# Altium schematic sheet P-MT3620RDB-1-0_FTDI.SchDoc: MT3620 RDB FTDI
size A3; CompanyName: Microsoft Research; DrawnBy: Stuart Taylor; Revision: 1.0; SheetNumber: 4; SheetTotal: 5; ProjectName: MT3620 Reference Development Board
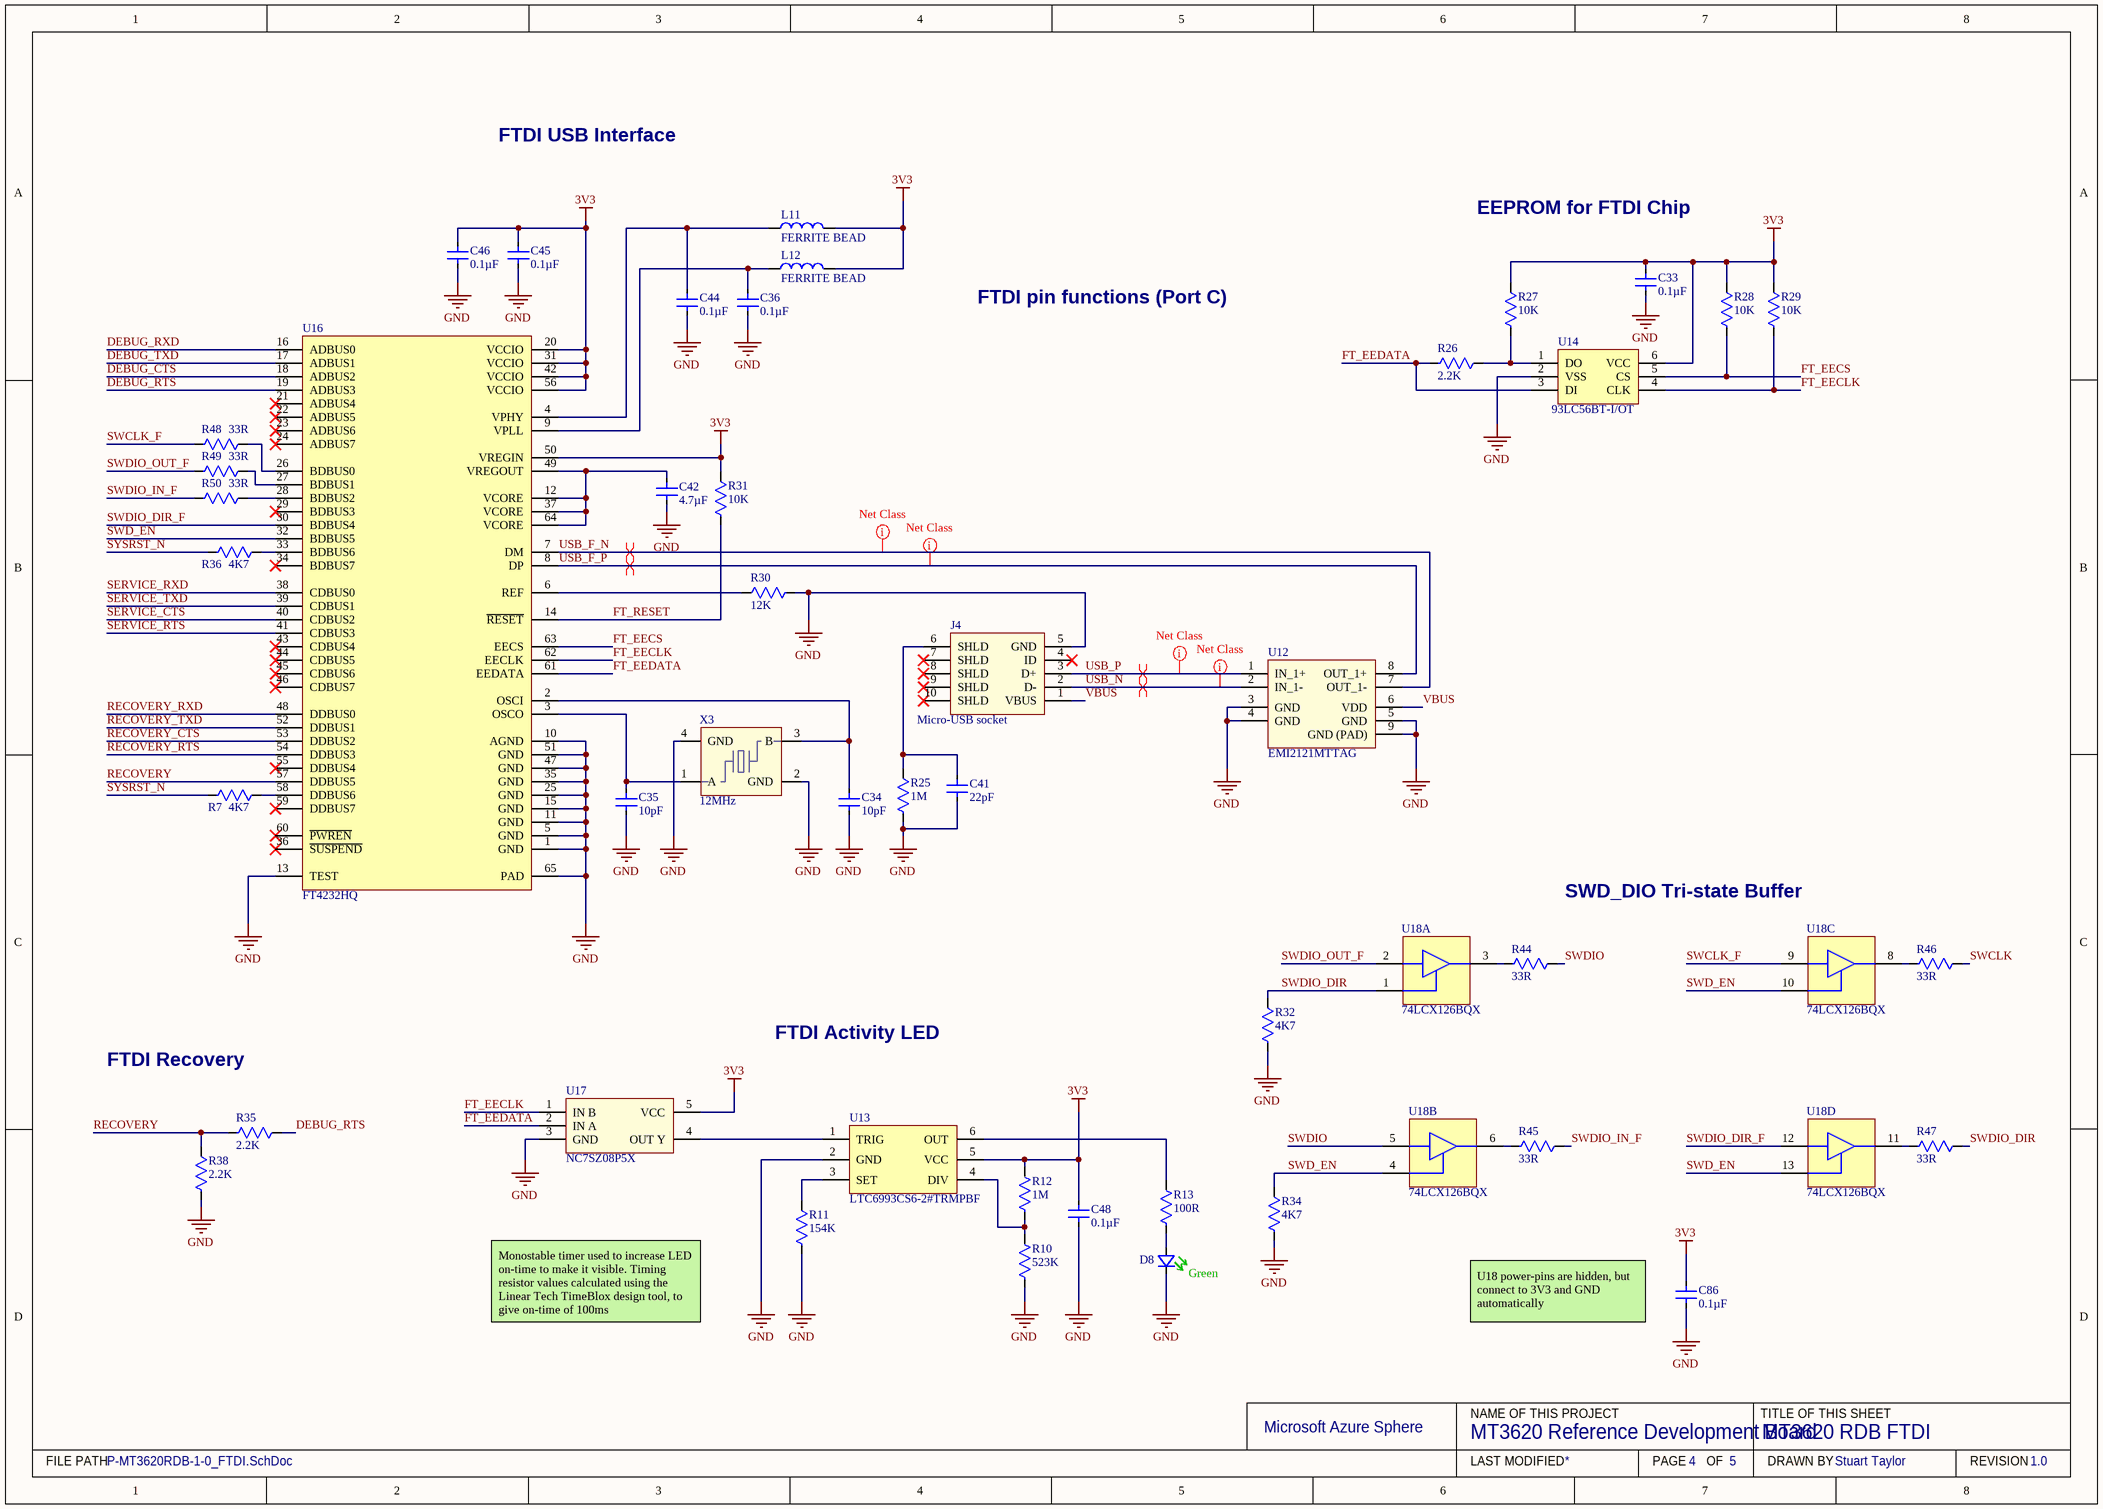
[diagram p0: P-MT3620RDB-1-0_FTDI.SchDoc]

## Parts
C33  0.1µF  [CAPC1005-EIA0402 0.55MM MED]
C34  10pF  [CAPC1005-EIA0402 0.55MM MED]
C35  10pF  [CAPC1005-EIA0402 0.55MM MED]
C36  0.1µF  [CAPC1005-EIA0402 0.55MM MED]
C41  22pF  [CAPC1005-EIA0402 0.55MM MED]
C42  4.7µF  [CAPC1005-EIA0402 0.55MM MED]
C44  0.1µF  [CAPC1005-EIA0402 0.55MM MED]
C45  0.1µF  [CAPC1005-EIA0402 0.55MM MED]
C46  0.1µF  [CAPC1005-EIA0402 0.55MM MED]
C48  0.1µF  [CAPC1005-EIA0402 0.55MM MED]
C86  0.1µF  [CAPC1005-EIA0402 0.55MM MED]
D8  Colour: Green  [Rohm SML-D12 Green]  (hidden comment: Green LED)
J4  Micro-USB socket  [MCR-B-S-RA-SMT-CS5-T/R]
L11  FERRITE BEAD  [CAPC1005-EIA0402 0.55MM MED]
L12  FERRITE BEAD  [CAPC1005-EIA0402 0.55MM MED]
R7  4K7  [RES 0402 MEDIUM DENSITY]
R10  523K  [RES 0402 MEDIUM DENSITY]
R11  154K  [RES 0402 MEDIUM DENSITY]
R12  1M  [RES 0402 MEDIUM DENSITY]
R13  100R  [RES 0402 MEDIUM DENSITY]
R25  1M  [RES 0402 MEDIUM DENSITY]
R26  2.2K  [RES 0402 MEDIUM DENSITY]
R27  10K  [RES 0402 MEDIUM DENSITY]
R28  10K  [RES 0402 MEDIUM DENSITY]
R29  10K  [RES 0402 MEDIUM DENSITY]
R30  12K  [RES 0402 MEDIUM DENSITY]
R31  10K  [RES 0402 MEDIUM DENSITY]
R32  4K7  [RES 0402 MEDIUM DENSITY]
R34  4K7  [RES 0402 MEDIUM DENSITY]
R35  2.2K  [RES 0402 MEDIUM DENSITY]
R36  4K7  [RES 0402 MEDIUM DENSITY]
R38  2.2K  [RES 0402 MEDIUM DENSITY]
R44  33R  [RES 0402 MEDIUM DENSITY]
R45  33R  [RES 0402 MEDIUM DENSITY]
R46  33R  [RES 0402 MEDIUM DENSITY]
R47  33R  [RES 0402 MEDIUM DENSITY]
R48  33R  [RES 0402 MEDIUM DENSITY]
R49  33R  [RES 0402 MEDIUM DENSITY]
R50  33R  [RES 0402 MEDIUM DENSITY]
U12  EMI2121MTTAG  [EMI2121MTTAG]
U13  LTC6993CS6-2#TRMPBF  [LTC6993CS6-2#TRMPBF]
U14  93LC56BT-I/OT  [SOT23-93C56B]
U16  FT4232HQ  [FTDI_TF4232HQ_64QFN]
U17  NC7SZ08P5X  [SC-70-5]
U18  74LCX126BQX  [74LCX126BQX]  (parts A,B,C,D of 4)
X3  12MHz  [TXC 8Z]

## Nets
3V3: C33.2 C45.2 C46.2 C48.2 C86.2 L11.2 L12.2 R12.1 R27.1 R28.1 R29.1 R31.1 U13.5(VCC) U14.6(VCC) U16.20(VCCIO) U16.31(VCCIO) U16.42(VCCIO) U16.50(VREGIN) U16.56(VCCIO) U17.5(VCC) U18.14(3V3)
GND: C33.1 C34.1 C35.1 C36.1 C41.1 C42.1 C44.1 C45.1 C46.1 C48.1 C86.1 D8.1(K) J4.5(GND) R10.2 R11.2 R25.2 R30.2 R32.2 R34.2 R38.2 U12.3(GND) U12.4(GND) U12.5(GND) U12.9(GND_(PAD)) U13.2(GND) U14.2(VSS) U16.1(GND) U16.5(GND) U16.10(AGND) U16.11(GND) U16.13(TEST) U16.15(GND) U16.25(GND) U16.35(GND) U16.47(GND) U16.51(GND) U16.65(PAD) U17.3(GND) U18.7(GND) X3.2(GND) X3.4(GND)
DEBUG_CTS: U16.18(ADBUS2)
DEBUG_RTS: R35.1 U16.19(ADBUS3)
DEBUG_RXD: U16.16(ADBUS0)
DEBUG_TXD: U16.17(ADBUS1)
FT_EECLK: R29.2 U14.4(CLK) U16.62(EECLK) U17.1(IN_B)
FT_EECS: R28.2 U14.5(CS) U16.63(EECS)
FT_EEDATA: R26.2 U14.3(DI) U16.61(EEDATA) U17.2(IN_A)
FT_RESET: R31.2 U16.14(~{RESET})
RECOVERY: R35.2 R38.1 U16.57(DDBUS5)
RECOVERY_CTS: U16.53(DDBUS2)
RECOVERY_RTS: U16.54(DDBUS3)
RECOVERY_RXD: U16.48(DDBUS0)
RECOVERY_TXD: U16.52(DDBUS1)
SERVICE_CTS: U16.40(CDBUS2)
SERVICE_RTS: U16.41(CDBUS3)
SERVICE_RXD: U16.38(CDBUS0)
SERVICE_TXD: U16.39(CDBUS1)
SWCLK: R46.1
SWCLK_F: R48.2 U18.9(3A)
SWD_EN: R34.1 U16.32(BDBUS5) U18.4(2OE) U18.10(3OE) U18.13(4OE)
SWDIO: R44.1 U18.5(2A)
SWDIO_DIR: R32.1 R47.1 U18.1(1OE)
SWDIO_DIR_F: U16.30(BDBUS4) U18.12(4A)
SWDIO_IN_F: R45.1 R50.2
SWDIO_OUT_F: R49.2 U18.2(1A)
SYSRST_N: R7.2 R36.2
USB_F_N: U12.7(OUT_1-) U16.7(DM)
USB_F_P: U12.8(OUT_1+) U16.8(DP)
USB_N: J4.2(D-) U12.2(IN_1-)
USB_P: J4.3(D+) U12.1(IN_1+)
VBUS: J4.1(VBUS) U12.6(VDD)
NetC34_2: C34.2 U16.2(OSCI) X3.3(B)
NetC35_2: C35.2 U16.3(OSCO) X3.1(A)
NetC36_2: C36.2 L12.1 U16.9(VPLL)
NetC41_2: C41.2 J4.6(SHLD) R25.1
NetC42_2: C42.2 U16.12(VCORE) U16.37(VCORE) U16.49(VREGOUT) U16.64(VCORE)
NetC44_2: C44.2 L11.1 U16.4(VPHY)
NetD8_2: D8.2(A) R13.2
NetR7_1: R7.1 U16.58(DDBUS6)
NetR10_1: R10.1 R12.2 U13.4(DIV)
NetR11_1: R11.1 U13.3(SET)
NetR13_1: R13.1 U13.6(OUT)
NetR26_1: R26.1 R27.2 U14.1(DO)
NetR30_1: R30.1 U16.6(REF)
NetR36_1: R36.1 U16.33(BDBUS6)
NetR44_2: R44.2 U18.3(1Y)
NetR45_2: R45.2 U18.6(2Y)
NetR46_2: R46.2 U18.8(3Y)
NetR47_2: R47.2 U18.11(4Y)
NetR48_1: R48.1 U16.26(BDBUS0)
NetR49_1: R49.1 U16.27(BDBUS1)
NetR50_1: R50.1 U16.28(BDBUS2)
NetU13_1: U13.1(TRIG) U17.4(OUT_Y)

Not connected (* = marked no-connect by the designer): J4 4(ID)* 7(SHLD)* 8(SHLD)* 9(SHLD)* 10(SHLD)*; U16 21(ADBUS4)* 22(ADBUS5)* 23(ADBUS6)* 24(ADBUS7)* 29(BDBUS3)* 34(BDBUS7)* 36(~{SUSPEND})* 43(CDBUS4)* 44(CDBUS5)* 45(CDBUS6)* 46(CDBUS7)* 55(DDBUS4)* 59(DDBUS7)* 60(~{PWREN})*

## Layout directives
differential pair: USB_F_N, USB_F_P, USB_N, USB_P
net class USB: USB_F_N, USB_F_P, USB_N, USB_P

## Notes on the sheet
- FTDI USB Interface
- EEPROM for FTDI Chip
- FTDI pin functions (Port C)
- SWD_DIO Tri-state Buffer
- FTDI Activity LED
- FTDI Recovery
- Monostable timer used to increase LED on-time to make it visible. Timing resistor values calculated using the Linear Tech TimeBlox design tool, to give on-time of 100ms
- (near C86) U18 power-pins are hidden, but connect to 3V3 and GND automatically
- Microsoft Azure Sphere
- NAME OF THIS PROJECT
- TITLE OF THIS SHEET
- FILE PATH
- LAST MODIFIED
- PAGE
- OF
- DRAWN BY
- REVISION

## Library data of the parts
C33 C36 C44-C46 C48 C86 = 0.1µF 0402 X7R 50V: CAP CER 0.1UF 50V 10% X7R 0402; Manufacturer: TDK Corporation; Manufacturer Part Number: C1005X7R1H104K050BB; Supplier 1: Digi-Key; RoHS: RoHS Compliant; Category: Capacitors; Stock 1: 47833; Pricing 1: 0.01305; Packaging: Tape & Reel (TR); Tolerance: ±10%; Voltage - Rated: 50V; Temperature Coefficient: X7R; Mounting Type: Surface Mount, MLCC; Operating Temperature: -55°C ~ 125°C; Applications: General Purpose; Package / Case: 0402 (1005 Metric); Size / Dimension: 0.039" L x 0.020" W (1.00mm x 0.50mm); Height - Seated (Max): -; Thickness (Max): 0.022" (0.55mm); Lead Spacing: -; Features: -; Lead Style: -; ComponentLink1URL: http://product.tdk.com/en/catalog/datasheets/mlcc_commercial_general_en.pdf; ComponentLink1Description: http://product.tdk.com/en/catalog/datasheets/mlcc_commercial_general_en.pdf; Supplier Part Number 1: 445-5932-2-ND; Ratings: -; Capacitance: 0.1µF
C34 C35 = 10pF 0402 C0G, NP0 50V: CAP CER 10PF 50V NP0 0402; Manufacturer: TDK Corporation; Manufacturer Part Number: C1005C0G1H100D050BA; Tolerance: ±0.5pF; Supplier 1: Digi-Key; RoHS: RoHS Compliant; Category: Capacitors; Stock 1: 47833; Pricing 1: 0.00274; Packaging: Tape & Reel (TR); Voltage - Rated: 50V; Temperature Coefficient: C0G, NP0; Mounting Type: Surface Mount, MLCC; Operating Temperature: -55°C ~ 125°C; Applications: General Purpose; Package / Case: 0402 (1005 Metric); Size / Dimension: 0.039" L x 0.020" W (1.00mm x 0.50mm); Height - Seated (Max): -; Thickness (Max): 0.022" (0.55mm); Lead Spacing: -; Features: -; Lead Style: -; ComponentLink1URL: http://product.tdk.com/en/catalog/datasheets/mlcc_commercial_general_en.pdf; ComponentLink1Description: http://product.tdk.com/en/catalog/datasheets/mlcc_commercial_general_en.pdf; Supplier Part Number 1: 445-1235-2-ND; Ratings: -; Capacitance: 10pF
C41 = 22pF 0402 C0G, NP0 50V: CAP CER 22PF 50V 5% NP0 0402; Manufacturer: TDK Corporation; Manufacturer Part Number: C1005C0G1H220J050BA; Supplier 1: Digi-Key; RoHS: RoHS Compliant; Category: Capacitors; Stock 1: 47833; Pricing 1: 0.00274; Packaging: Tape & Reel (TR); Tolerance: ±5%; Voltage - Rated: 50V; Temperature Coefficient: C0G, NP0; Mounting Type: Surface Mount, MLCC; Operating Temperature: -55°C ~ 125°C; Applications: General Purpose; Package / Case: 0402 (1005 Metric); Size / Dimension: 0.039" L x 0.020" W (1.00mm x 0.50mm); Height - Seated (Max): -; Thickness (Max): 0.022" (0.55mm); Lead Spacing: -; Features: -; Lead Style: -; ComponentLink1URL: http://product.tdk.com/en/catalog/datasheets/mlcc_commercial_general_en.pdf; ComponentLink1Description: http://product.tdk.com/en/catalog/datasheets/mlcc_commercial_general_en.pdf; Supplier Part Number 1: 445-1239-2-ND; Ratings: -; Capacitance: 22pF
C42 = 4.7µF 0402 X5R 10V: CAP CER 4.7UF 10V 10% X5R 0402; Manufacturer: TDK Corporation; Manufacturer Part Number: C1005X5R1A475K050BC; Supplier 1: Digi-Key; RoHS: RoHS Compliant; Category: Capacitors; Stock 1: 47833; Pricing 1: 0.06265; Packaging: Tape & Reel (TR); Tolerance: ±10%; Voltage - Rated: 10V; Temperature Coefficient: X5R; Mounting Type: Surface Mount, MLCC; Operating Temperature: -55°C ~ 125°C; Applications: General Purpose; Package / Case: 0402 (1005 Metric); Size / Dimension: 0.039" L x 0.020" W (1.00mm x 0.50mm); Height - Seated (Max): -; Thickness (Max): 0.022" (0.55mm); Lead Spacing: -; Features: -; Lead Style: -; ComponentLink1URL: http://product.tdk.com/en/catalog/datasheets/mlcc_commercial_general_en.pdf; ComponentLink1Description: http://product.tdk.com/en/catalog/datasheets/mlcc_commercial_general_en.pdf; Supplier Part Number 1: 445-13820-2-ND; Ratings: -; Capacitance: 4.7µF
D8 = SML-D12P: 1.6 x 0.8 x 0.55mm (0603) LED 560nm Green; Manufacturer: Rohm Semiconductor; Manufacturer Part Number: SML-D12P8WT86; Millicandela Rating: 6.3mcd; Voltage - Forward (Vf) (Typ): 2.2V; Current - Test: 20mA; Lens Type: Diffused, White; Lens Style/Size: Rectangle with Flat Top, 1.2mm x 0.8mm; Supplier 1: Digi-Key; RoHS: RoHS Compliant; Category: Optoelectronics; Stock 1: 19305; Pricing 1: 1=0.38, 10=0.279, 25=0.2232, 100=0.1478, 250=0.1046, 500=0.08926, 1000=0.06974 (GBP); Packaging: Cut Tape (CT); Wavelength - Dominant: 560nm; Wavelength - Peak: -; Viewing Angle: -; Package / Case: 0603 (1608 Metric); Size / Dimension: 1.60mm L x 0.80mm W; Height: 0.55mm; Mounting Type: Surface Mount; Luminous Flux @ Current - Test: -; ComponentLink1URL: http://rohmfs.rohm.com/en/products/databook/datasheet/opto/led/chip_mono/sml-d1.pdf; ComponentLink1Description: http://rohmfs.rohm.com/en/products/databook/datasheet/opto/led/chip_mono/sml-d1.pdf; Supplier Part Number 1: 511-1579-1-ND
J4 = MCR-B-S-RA-SMT-CS5-T/R: Manufacturer: Adam Tech; Manufacturers Part Number: MCR-B-S-RA-SMT-CS5-T/R; Supplier Part Number 1: MCR-B-S-RA-SMT-CS5-T/R; Supplier 1: Adam Tech
L11 L12 = BLM15PD121SN1D: FERRITE BEAD 120 OHM 0402 1LN; Manufacturer: Murata Electronics North America; Filter Type: Power Line; Number of Lines: 1; Impedance @ Frequency: 120 Ohm @ 100MHz; Current Rating (Max): 1.3A; DC Resistance (DCR) (Max): 90 mOhm; Supplier 1: Digi-Key; Manufacturer Part Number: BLM15PD121SN1D; RoHS: RoHS Compliant; Category: Filters; Stock 1: 50000; Pricing 1: 10000=0.01677, 20000=0.01557, 30000=0.0154, 50000=0.01498 (GBP); Packaging: Tape & Reel (TR); Ratings: -; Operating Temperature: -55°C ~ 125°C; Package / Case: 0402 (1005 Metric); Mounting Type: Surface Mount; Height (Max): 0.022" (0.55mm); Size / Dimension: 0.039" L x 0.020" W (1.00mm x 0.50mm); ComponentLink1URL: http://search.murata.co.jp/Ceramy/image/img/PDF/ENG/L0110S0100BLM15PG~BLM15PD.pdf; ComponentLink1Description: http://search.murata.co.jp/Ceramy/image/img/PDF/ENG/L0110S0100BLM15PG~BLM15PD.pdf; Supplier Part Number 1: 490-5203-2-ND
R7 R32 R34 R36 = 4.7K: RES 4.7K OHM 1/10W 1% 0402 SMD; Manufacturer: Panasonic Electronic Components; Manufacturer Part Number: ERJ-2RKF4701X; Power (Watts): 0.1W, 1/10W; Temperature Coefficient: ±100ppm/°C; Supplier 1: Digi-Key; Supplier Part Number 1: P4.70KLCT-ND; RoHS: RoHS Compliant; Category: Resistors; Stock 1: 1251398; Pricing 1: 1=0.07, 50=0.0128, 100=0.0097, 250=0.0072, 500=0.00532, 1000=0.00355, 5000=0.0025 (GBP); Packaging: Cut Tape (CT); Tolerance: ±1%; Composition: Thick Film; Features: -; Package / Case: 0402 (1005 Metric); Supplier Device Package: 0402; Size / Dimension: 0.039" L x 0.020" W (1.00mm x 0.50mm); Height: 0.016" (0.40mm); Number of Terminations: 2; ComponentLink1URL: http://industrial.panasonic.com/www-cgi/jvcr13pz.cgi?E+PZ+3+AOA0002+ERJ2RKF4701X+7+WW; ComponentLink1Description: http://industrial.panasonic.com/www-cgi/jvcr13pz.cgi?E+PZ+3+AOA0002+ERJ2RKF4701X+7+WW; Resistance (Ohms): 4K7
R10 = 523K: RES 523K OHM 1/10W 1% 0402 SMD; Manufacturer: Panasonic Electronic Components; Manufacturer Part Number: ERJ-2RKF5233X; Power (Watts): 0.1W, 1/10W; Temperature Coefficient: ±100ppm/°C; Supplier 1: Digi-Key; Supplier Part Number 1: P523KLCT-ND; RoHS: RoHS Compliant; Category: Resistors; Stock 1: 62611; Pricing 1: 1=0.07, 50=0.0128, 100=0.0097, 250=0.0072, 500=0.00532, 1000=0.00355, 5000=0.0025 (GBP); Packaging: Cut Tape (CT); Tolerance: ±1%; Composition: Thick Film; Features: -; Package / Case: 0402 (1005 Metric); Supplier Device Package: 0402; Size / Dimension: 0.039" L x 0.020" W (1.00mm x 0.50mm); Height: 0.016" (0.40mm); Number of Terminations: 2; ComponentLink1URL: http://industrial.panasonic.com/www-cgi/jvcr13pz.cgi?E+PZ+3+AOA0002+ERJ2RKF5233X+7+WW; ComponentLink1Description: http://industrial.panasonic.com/www-cgi/jvcr13pz.cgi?E+PZ+3+AOA0002+ERJ2RKF5233X+7+WW; Resistance (Ohms): 523K
R11 = 154K: RES 154K OHM 1/10W 1% 0402 SMD; Manufacturer: Panasonic Electronic Components; Manufacturer Part Number: ERJ-2RKF1543X; Power (Watts): 0.1W, 1/10W; Temperature Coefficient: ±100ppm/°C; Supplier 1: Digi-Key; Supplier Part Number 1: P154KLCT-ND; RoHS: RoHS Compliant; Category: Resistors; Stock 1: 93656; Pricing 1: 1=0.07, 50=0.0128, 100=0.0097, 250=0.0072, 500=0.00532, 1000=0.00355, 5000=0.0025 (GBP); Packaging: Cut Tape (CT); Tolerance: ±1%; Composition: Thick Film; Features: -; Package / Case: 0402 (1005 Metric); Supplier Device Package: 0402; Size / Dimension: 0.039" L x 0.020" W (1.00mm x 0.50mm); Height: 0.016" (0.40mm); Number of Terminations: 2; ComponentLink1URL: http://industrial.panasonic.com/www-cgi/jvcr13pz.cgi?E+PZ+3+AOA0002+ERJ2RKF1543X+7+WW; ComponentLink1Description: http://industrial.panasonic.com/www-cgi/jvcr13pz.cgi?E+PZ+3+AOA0002+ERJ2RKF1543X+7+WW; Resistance (Ohms): 154K
R12 R25 = 1M: RES 1M OHM 1/10W 1% 0402 SMD; Manufacturer: Panasonic Electronic Components; Manufacturer Part Number: ERJ-2RKF1004X; Power (Watts): 0.1W, 1/10W; Temperature Coefficient: ±100ppm/°C; Supplier 1: Digi-Key; Supplier Part Number 1: P1.00MLCT-ND; RoHS: RoHS Compliant; Category: Resistors; Stock 1: 749171; Pricing 1: 1=0.07, 50=0.0128, 100=0.0097, 250=0.0072, 500=0.00532, 1000=0.00355, 5000=0.0025 (GBP); Packaging: Cut Tape (CT); Tolerance: ±1%; Composition: Thick Film; Features: -; Package / Case: 0402 (1005 Metric); Supplier Device Package: 0402; Size / Dimension: 0.039" L x 0.020" W (1.00mm x 0.50mm); Height: 0.016" (0.40mm); Number of Terminations: 2; ComponentLink1URL: http://industrial.panasonic.com/www-cgi/jvcr13pz.cgi?E+PZ+3+AOA0002+ERJ2RKF1004X+7+WW; ComponentLink1Description: http://industrial.panasonic.com/www-cgi/jvcr13pz.cgi?E+PZ+3+AOA0002+ERJ2RKF1004X+7+WW; Resistance (Ohms): 1M
R13 = 100R: RES 100 OHM 1/10W 1% 0402 SMD; Manufacturer: Panasonic Electronic Components; Manufacturer Part Number: ERJ-2RKF1000X; Power (Watts): 0.1W, 1/10W; Temperature Coefficient: ±100ppm/°C; Supplier 1: Digi-Key; RoHS: RoHS Compliant; Category: Resistors; Stock 1: 3662159; Pricing 1: 1=0.07, 50=0.0128, 100=0.0097, 250=0.0072, 500=0.00532, 1000=0.00355, 5000=0.0025 (GBP); Packaging: Cut Tape (CT); Tolerance: ±1%; Composition: Thick Film; Features: -; Package / Case: 0402 (1005 Metric); Supplier Device Package: 0402; Size / Dimension: 0.039" L x 0.020" W (1.00mm x 0.50mm); Height: 0.016" (0.40mm); Number of Terminations: 2; ComponentLink1URL: http://industrial.panasonic.com/www-cgi/jvcr13pz.cgi?E+PZ+3+AOA0002+ERJ2RKF1000X+7+WW; ComponentLink1Description: http://industrial.panasonic.com/www-cgi/jvcr13pz.cgi?E+PZ+3+AOA0002+ERJ2RKF1000X+7+WW; Supplier Part Number 1: P100LCT-ND; Resistance (Ohms): 100R
R26 R35 R38 = 2.2K: RES 2.2K OHM 1/10W 1% 0402 SMD; Manufacturer: Panasonic Electronic Components; Manufacturer Part Number: ERJ-2RKF2201X; Power (Watts): 0.1W, 1/10W; Temperature Coefficient: ±100ppm/°C; Supplier 1: Digi-Key; Supplier Part Number 1: P2.20KLCT-ND; RoHS: RoHS Compliant; Category: Resistors; Stock 1: 529147; Pricing 1: 1=0.07, 50=0.0128, 100=0.0097, 250=0.0072, 500=0.00532, 1000=0.00355, 5000=0.0025 (GBP); Packaging: Cut Tape (CT); Tolerance: ±1%; Composition: Thick Film; Features: -; Package / Case: 0402 (1005 Metric); Supplier Device Package: 0402; Size / Dimension: 0.039" L x 0.020" W (1.00mm x 0.50mm); Height: 0.016" (0.40mm); Number of Terminations: 2; ComponentLink1URL: http://industrial.panasonic.com/www-cgi/jvcr13pz.cgi?E+PZ+3+AOA0002+ERJ2RKF2201X+7+WW; ComponentLink1Description: http://industrial.panasonic.com/www-cgi/jvcr13pz.cgi?E+PZ+3+AOA0002+ERJ2RKF2201X+7+WW; Resistance (Ohms): 2.2K
R27-R29 R31 = 10K: RES 10K OHM 1/10W 1% 0402 SMD; Manufacturer: Panasonic Electronic Components; Manufacturer Part Number: ERJ-2RKF1002X; Power (Watts): 0.1W, 1/10W; Temperature Coefficient: ±100ppm/°C; Supplier 1: Digi-Key; Supplier Part Number 1: P10.0KLCT-ND; RoHS: RoHS Compliant; Category: Resistors; Stock 1: 4805447; Pricing 1: 1=0.07, 50=0.0128, 100=0.0097, 250=0.0072, 500=0.00532, 1000=0.00355, 5000=0.0025 (GBP); Packaging: Cut Tape (CT); Tolerance: ±1%; Composition: Thick Film; Features: -; Package / Case: 0402 (1005 Metric); Supplier Device Package: 0402; Size / Dimension: 0.039" L x 0.020" W (1.00mm x 0.50mm); Height: 0.016" (0.40mm); Number of Terminations: 2; ComponentLink1URL: http://industrial.panasonic.com/www-cgi/jvcr13pz.cgi?E+PZ+3+AOA0002+ERJ2RKF1002X+7+WW; ComponentLink1Description: http://industrial.panasonic.com/www-cgi/jvcr13pz.cgi?E+PZ+3+AOA0002+ERJ2RKF1002X+7+WW; Resistance (Ohms): 10K
R30 = 12K: RES 12K OHM 1/10W 1% 0402 SMD; Manufacturer: Panasonic Electronic Components; Manufacturer Part Number: ERJ-2RKF1202X; Power (Watts): 0.1W, 1/10W; Temperature Coefficient: ±100ppm/°C; Supplier 1: Digi-Key; Supplier Part Number 1: P12.0KLCT-ND; RoHS: RoHS Compliant; Category: Resistors; Stock 1: 165467; Pricing 1: 1=0.07, 50=0.0128, 100=0.0097, 250=0.0072, 500=0.00532, 1000=0.00355, 5000=0.0025 (GBP); Packaging: Cut Tape (CT); Tolerance: ±1%; Composition: Thick Film; Features: -; Package / Case: 0402 (1005 Metric); Supplier Device Package: 0402; Size / Dimension: 0.039" L x 0.020" W (1.00mm x 0.50mm); Height: 0.016" (0.40mm); Number of Terminations: 2; ComponentLink1URL: http://industrial.panasonic.com/www-cgi/jvcr13pz.cgi?E+PZ+3+AOA0002+ERJ2RKF1202X+7+WW; ComponentLink1Description: http://industrial.panasonic.com/www-cgi/jvcr13pz.cgi?E+PZ+3+AOA0002+ERJ2RKF1202X+7+WW; Resistance (Ohms): 12K
R44-R50 = 33R: RES 33 OHM 1/10W 1% 0402 SMD; Manufacturer: Panasonic Electronic Components; Manufacturer Part Number: ERJ-2RKF33R0X; Power (Watts): 0.1W, 1/10W; Temperature Coefficient: ±100ppm/°C; Supplier 1: Digi-Key; RoHS: RoHS Compliant; Category: Resistors; Stock 1: 533394; Pricing 1: 1=0.07, 50=0.0128, 100=0.0097, 250=0.0072, 500=0.00532, 1000=0.00355, 5000=0.0025 (GBP); Packaging: Cut Tape (CT); Tolerance: ±1%; Composition: Thick Film; Features: -; Package / Case: 0402 (1005 Metric); Supplier Device Package: 0402; Size / Dimension: 0.039" L x 0.020" W (1.00mm x 0.50mm); Height: 0.016" (0.40mm); Number of Terminations: 2; ComponentLink1URL: http://industrial.panasonic.com/www-cgi/jvcr13pz.cgi?E+PZ+3+AOA0002+ERJ2RKF33R0X+7+WW; ComponentLink1Description: http://industrial.panasonic.com/www-cgi/jvcr13pz.cgi?E+PZ+3+AOA0002+ERJ2RKF33R0X+7+WW; Supplier Part Number 1: P33.0LCT-ND; Resistance (Ohms): 33R
U12 = EMI2121MTTAG: IC FILTER COMMON MODE ESD 8WDFN; Manufacturer: ON Semiconductor; PCN Assembly/Origin: DFN Pkg Filters 12/Jun/2013 Addition of FAB 10 Wafer Source 04/Nov/2013 Assembly Site Addition 06/Mar/2014; Filter Type: Data, Signal Line; Number of Lines: 2; Current: 100mA; DC Resistance (DCR): 8 Ohm; Online Catalog: EMI; Other Names: EMI2121MTTAGOSDKR; Supplier 1: Digikey; Manufacturer Part Number: EMI2121MTTAG; Stock 1: 2368; Pricing 1: 1=0.85, 10=0.76, 100=0.5923, 500=0.4893, 1000=0.3863 (USD); Standard Package: 1; Category: Filters; Family: Common Mode Chokes; Series: -; Packaging: Digi-Reel®; Inductance: -; Impedance: -; Mounting Type: Surface Mount; Size / Dimension: 0.087" L x 0.079" W (2.20mm x 2.00mm); Height (Max): 0.031" (0.80mm); Package / Case: 8-WFDFN Exposed Pad; Operating Temperature: -40°C ~ 85°C; ComponentLink1URL: https://datasheet.ciiva.com/3067/emi2121mt-d-3067884.pdf; ComponentLink1Description: https://datasheet.ciiva.com/3067/emi2121mt-d-3067884.pdf; ComponentLink2URL: https://datasheet.ciiva.com/12394/emi2121mt-d-72518-12394918.pdf; ComponentLink2Description: https://datasheet.ciiva.com/12394/emi2121mt-d-72518-12394918.pdf; ComponentLink3URL: https://datasheet.ciiva.com/6214/emi2121mt-d-6214625.pdf; ComponentLink3Description: https://datasheet.ciiva.com/6214/emi2121mt-d-6214625.pdf; ComponentLink4URL: https://datasheet.ciiva.com/16437/emi2121mt-d-16437709.pdf; ComponentLink4Description: https://datasheet.ciiva.com/16437/emi2121mt-d-16437709.pdf; ComponentLink5URL: https://datasheet.ciiva.com/6214/emi2121mt-d-6214622.pdf; ComponentLink5Description: https://datasheet.ciiva.com/6214/emi2121mt-d-6214622.pdf; ComponentLink6URL: https://datasheet.ciiva.com/6214/emi2121mt-d-6214619.pdf; ComponentLink6Description: https://datasheet.ciiva.com/6214/emi2121mt-d-6214619.pdf; ComponentLink7URL: https://datasheet.ciiva.com/15162/getdatasheetpartid-686641-15162525.pdf; ComponentLink7Description: https://datasheet.ciiva.com/15162/getdatasheetpartid-686641-15162525.pdf; Supplier Part Number 1: EMI2121MTTAGOSCT-ND
U13 = LTC6993CS6-2#TRMPBF: LINEAR TECHNOLOGY - LTC6993CS6-2#TRMPBF - GENERATOR, PULSE, TIMERBLOX, 6SOT-23; Supply Voltage Min: 2.25; Supply Voltage Max: 5.5; Digital IC Case: TSOT-23; No. of Pins: 6; SVHC: No SVHC (17-Dec-2015); Clock External Input: No; No. of Timers: 1; Operating Mode: Monostable; Resonator Case: SMD; Supply Voltage Range: 2.25V to 5.5V<!--FANDB--><div class="features-and-benefits-container"><div class="features-and-benefits-description"><span class="features-benefits-value">The LTC6993CS6-2#TRMPBF is a Monostable Pulse Generator (one shot) with a programmable pulse width of 1?s to 33.6 seconds. The LTC6993 is part of the TimerBlox&reg; Supplier 1: Farnell; Manufacturer: LINEAR TECHNOLOGY; Manufacturer Part Number: LTC6993CS6-2#TRMPBF; RoHS: YES; Stock 1: 1214; Pricing 1: 1=2.64, 25=2.02, 100=1.18 (GBP); Frequency: -; Operating Temperature Min: 0; Operating Temperature Max: 70; Packaging: Cut Tape; Product Range: -; MSL: MSL 1 - Unlimited; Operating Temperature Range: 0°C to +70; ComponentLink1URL: http://www.farnell.com/datasheets/1441932.pdf; ComponentLink1Description: http://www.farnell.com/datasheets/1441932.pdf; ComponentLink2URL: http://www.farnell.com/simulation/1753930.zip; ComponentLink2Description: http://www.farnell.com/simulation/1753930.zip; ComponentLink3URL: http://www.farnell.com/datasheets/1999324.pdf; ComponentLink3Description: http://www.farnell.com/datasheets/1999324.pdf; ComponentLink4URL: http://www.farnell.com/cad/1542631.zip; ComponentLink4Description: http://www.farnell.com/cad/1542631.zip; Supplier Part Number 1: 1848054
U14 = 93LC56BT-I/OT: IC EEPROM 2KBIT 2MHZ SOT23-6; Manufacturer: Microchip Technology; Format - Memory: EEPROMs - Serial; Memory Size: 2K (128 x 16); Interface: Microwire, 3-Wire Serial; Voltage - Supply: 2.5 V ~ 5.5 V; Supplier 1: Digi-Key; Manufacturer Part Number: 93LC56BT-I/OT; RoHS: RoHS Compliant; Category: Integrated Circuits (ICs); Stock 1: 13464; Pricing 1: 1=0.17, 25=0.164, 100=0.1612 (GBP); Packaging: Cut Tape (CT); Part Status: Active; Memory Type: EEPROM; Speed: 2MHz; Operating Temperature: -40°C ~ 85°C (TA); Package / Case: SOT-23-6; Supplier Device Package: SOT-23-6; ComponentLink1URL: http://www.microchip.com/mymicrochip/filehandler.aspx?ddocname=en013939; ComponentLink1Description: http://www.microchip.com/mymicrochip/filehandler.aspx?ddocname=en013939; Supplier Part Number 1: 93LC56BT-I/OTCT-ND
U16 = FT4232HQ: IC USB HS QUAD UART/SYNC 64-QFN; Manufacturer: FTDI, Future Technology Devices International Ltd; Manufacturer Part Number: FT4232HQ-REEL; Function: Bridge, USB to UART; Interface: UART; Standards: USB 2.0; Voltage - Supply: 3 V ~ 3.6 V; Current - Supply: 70mA; Supplier 1: Digi-Key; RoHS: RoHS Compliant; Category: Integrated Circuits (ICs); Stock 1: 18296; Pricing 1: 1=5.99, 10=5.785, 50=5.5452, 100=4.6827, 250=4.1692, 500=3.79954 (GBP); Packaging: Cut Tape (CT); Protocol: USB; Operating Temperature: -40°C ~ 85°C; Package / Case: 64-VFQFN Exposed Pad; Supplier Device Package: 64-QFN (9x9); ComponentLink1URL: http://www.ftdichip.com/Support/Documents/DataSheets/ICs/DS_FT4232H.pdf; ComponentLink1Description: http://www.ftdichip.com/Support/Documents/DataSheets/ICs/DS_FT4232H.pdf; Supplier Part Number 1: 768-1027-1-ND
U17 = NC7SZ08P5X: IC GATE AND 1CH 2-INP SC-70-5; Manufacturer: Fairchild Semiconductor; Logic Type: AND Gate; Number of Circuits: 1; Number of Inputs: 2; Voltage - Supply: 1.65 V ~ 5.5 V; Current - Quiescent (Max): 2µA; Current - Output High, Low: 32mA, 32mA; Max Propagation Delay @ V, Max CL: 4.5ns @ 5V, 50pF; Supplier 1: Digi-Key; Manufacturer Part Number: NC7SZ08P5X; RoHS: RoHS Compliant; Category: Integrated Circuits (ICs); Stock 1: 29087; Pricing 1: 1=0.26, 10=0.216, 100=0.1144, 500=0.07526, 1000=0.05127 (GBP); Packaging: Cut Tape (CT); Part Status: Active; Features: -; Logic Level - Low: -; Logic Level - High: -; Operating Temperature: -40°C ~ 85°C; Mounting Type: Surface Mount; Supplier Device Package: SC-70-5; Package / Case: 5-TSSOP, SC-70-5, SOT-353; ComponentLink1URL: http://www.fairchildsemi.com/datasheets/NC/NC7SZ08.pdf; ComponentLink1Description: http://www.fairchildsemi.com/datasheets/NC/NC7SZ08.pdf; Supplier Part Number 1: NC7SZ08P5XCT-ND
U18 = 74LCX126BQX: IC BUFFER QUAD LV N-INV 14DQFN; Manufacturer: Fairchild Semiconductor; Number of Bits: 4; Max Supply Voltage: 3.6V; Min Supply Voltage: 2V; Propagation Delay: 7.8ns; Logic Function: Buffer,Inverting; Low Level Output Current: 24mA; Polarity: Non-Inverting; Number of Bits per Element: 1; High Level Output Current: -24mA; Quiescent Current: 10uA; Supplier 1: Digi-Key; Manufacturer Part Number: 74LCX126BQX; Stock 1: 15117; Pricing 1: 1=0.85, 10=0.744, 100=0.5702, 500=0.4507, 1000=0.3606 (USD); Mount: Surface Mount; Number of Pins: 14; Weight: 0.12g; Contact Plating: Gold; Min Operating Temperature: -40°C; Max Operating Temperature: 85°C; Packaging: Tape and Reel; Number of Channels: 4; Number of Inputs: 4; Number of Outputs: 4; Package Quantity: 3000; Number of Elements: 4; Number of Input Lines: 4; Number of Output Lines: 4; Turn-On Delay Time: 7.8ns; Radiation Hardening: No; Lead Free: Lead Free; ComponentLink1URL: https://datasheet.ciiva.com/26861/74lcx126bqx-26861526.pdf; ComponentLink1Description: https://datasheet.ciiva.com/26861/74lcx126bqx-26861526.pdf; ComponentLink2URL: https://datasheet.ciiva.com/1837/74lcx126-1837158.pdf; ComponentLink2Description: https://datasheet.ciiva.com/1837/74lcx126-1837158.pdf; ComponentLink3URL: https://datasheet.ciiva.com/28425/74lcx126-28425643.pdf; ComponentLink3Description: https://datasheet.ciiva.com/28425/74lcx126-28425643.pdf; ComponentLink4URL: https://datasheet.ciiva.com/1837/74lcx126-1837156.pdf; ComponentLink4Description: https://datasheet.ciiva.com/1837/74lcx126-1837156.pdf; ComponentLink5URL: https://datasheet.ciiva.com/1837/74lcx126-1837157.pdf; ComponentLink5Description: https://datasheet.ciiva.com/1837/74lcx126-1837157.pdf; ComponentLink6URL: https://datasheet.ciiva.com/8306/74lcx126-8306053.pdf; ComponentLink6Description: https://datasheet.ciiva.com/8306/74lcx126-8306053.pdf; Supplier Part Number 1: 74LCX126BQXDKR-ND
X3 = CRYSTAL 12MHz 18pF SMD: CRYSTAL 12.000 MHZ 18PF SMD; Manufacturer: TXC CORPORATION; Manufacturer Part Number: 8Z-12.000MAAJ-T; Frequency Stability: ±30ppm; Operating Mode: Fundamental; ESR: 100R max; Shunt capacitance: 3.0pF max.; Supplier 1: Digi-Key; RoHS: RoHS Compliant; Category: Crystals and Oscillators; Stock 1: 5365; Pricing 1: 1=1.55, 10=1.347, 50=1.1812, 100=0.9326, 500=0.78752, 1000=0.62172 (GBP); Type: MHz Crystal; Frequency Tolerance: ±30ppm; Load Capacitance: 18pF; Operating Temperature: -20°C ~ 70°C; Mounting Type: Surface Mount; Package / Case: 4-SMD, No Lead (DFN, LCC); Size / Dimension: 0.098" L x 0.079" W (2.50mm x 2.00mm); Height: 0.022" (0.55mm); Packaging: Cut Tape (CT); ComponentLink1URL: http://www.txccrystal.com/images/pdf/8z.pdf; ComponentLink1Description: http://www.txccrystal.com/images/pdf/8z.pdf; Supplier Part Number 1: 887-1487-1-ND; Frequency: 12MHz